# Altium schematic sheet USB.SchDoc
size A
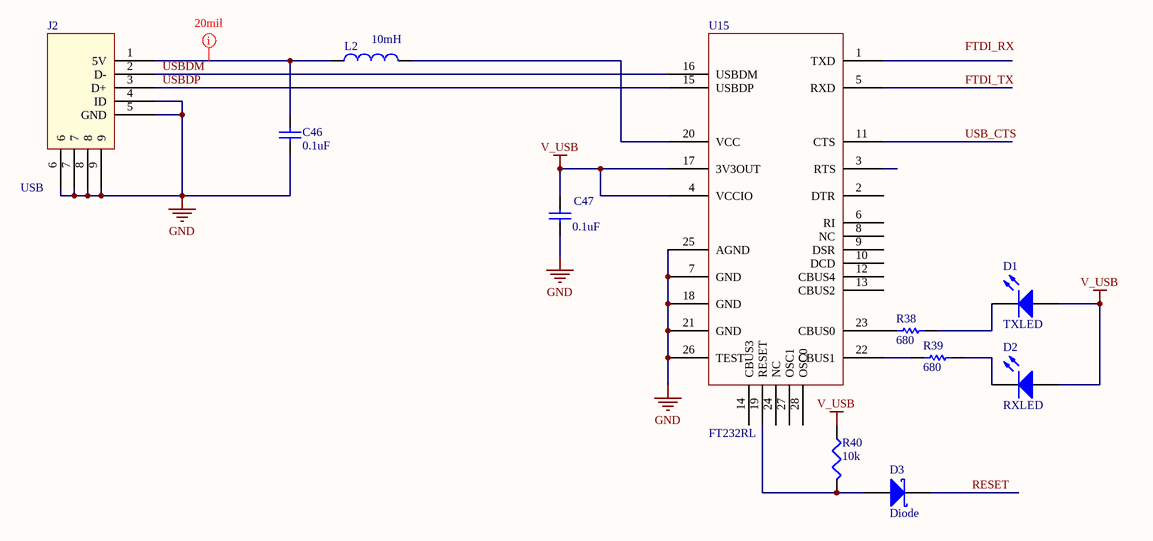
[diagram p0: USB.SchDoc]

## Parts
C46  value 0.1uF  [CAPC1005L]
C47  value 0.1uF  [CAPC1005L]
D1  TXLED  [INDC2012L]
D2  RXLED  [INDC2012L]
D3  Diode  [SurfaceMount(603)]
J2  USB  [USB Minib (thru-hole)]
L2  value 10mH  [INDC2012L]  (hidden comment: Inductor)
R38  value 680  [RESC1608L]
R39  value 680  [RESC1608L]
R40  value 10k  [RESC1608L]  (hidden comment: Res3)
U15  FT232RL  [SSOP-28]

## Nets
GND: C46.1 C47.1 J2.4(ID) J2.5(GND) J2.6 J2.7 J2.8 J2.9 U15.7(GND) U15.18(GND) U15.21(GND) U15.25(AGND) U15.26(TEST)
V_USB: C47.2 D1.1(A) D2.1(A) R40.1 U15.4(VCCIO) U15.17(3V3OUT)
FTDI_TX: U15.5(RXD)
RESET: D3.1(K)
USB_CTS: U15.11(CTS)
USBDM: J2.2(D-) U15.16(USBDM)
USBDP: J2.3(D+) U15.15(USBDP)
NetC46_2: C46.2 J2.1(5V) L2.1
NetD1_2: D1.2(K) R38.2
NetD2_2: D2.2(K) R39.2
NetD3_3: D3.3(A) R40.2 U15.19(RESET)
NetL2_2: L2.2 U15.20(VCC)
NetR38_1: R38.1 U15.23(CBUS0)
NetR39_1: R39.1 U15.22(CBUS1)

Not connected (* = marked no-connect by the designer): U15 1(TXD) 2(DTR) 3(RTS) 6(RI) 8(NC) 9(DSR) 10(DCD) 12(CBUS4) 13(CBUS2) 14(CBUS3) 24(NC) 27(OSC1) 28(OSC0)

## Layout directives
rule Width Constraint [Pref Width = 10mil    Min Width = 10mil    Max Width = 20mil]: NetC46_2

## Notes on the sheet
- Labels drawn without touching a wire or pin: FTDI_RX

## Library data of the parts
C46 C47 = Cap: Capacitor; Published: 8-Jun-2000; LatestRevisionDate: 17-Jul-2002; LatestRevisionNote: Re-released for DXP Platform.; PackageReference: RAD-0.3; Publisher: Altium Limited
D1 D2 = LED2: Typical RED, GREEN, YELLOW, AMBER GaAs LED; Published: 8-Jun-2000; LatestRevisionDate: 17-Jul-2002; LatestRevisionNote: Re-released for DXP Platform.; PackageVersion: Feb-2002; PackageReference: 3.2X1.6X1.1; Publisher: Altium Limited
D3 = SchottkeyDiode
J2 = USB-ConnTH
L2 = Inductor: Code_IEC: 1005; Published: 8-Jun-2000; LatestRevisionDate: 29-May-2009; LatestRevisionNote: IPC-7351 Footprint Added.; PackageReference: 0402-A; Publisher: Altium Limited; PackageDescription: Chip Inductor; Code_JEITA: 0402
R38 R39 = Res1: Resistor; Published: 8-Jun-2000; LatestRevisionDate: 17-Jul-2002; LatestRevisionNote: Re-released for DXP Platform.; PackageReference: AXIAL-0.3; Publisher: Altium Limited
R40 = Res3: Resistor; Published: 8-Jun-2000; LatestRevisionDate: 29-May-2009; LatestRevisionNote: IPC-7351 Footprint Added.; PackageReference: J1-0603; Publisher: Altium Limited; PackageDescription: Chip Resistor